# Altium schematic sheet HW_HDSP2072.SchDoc
size A3
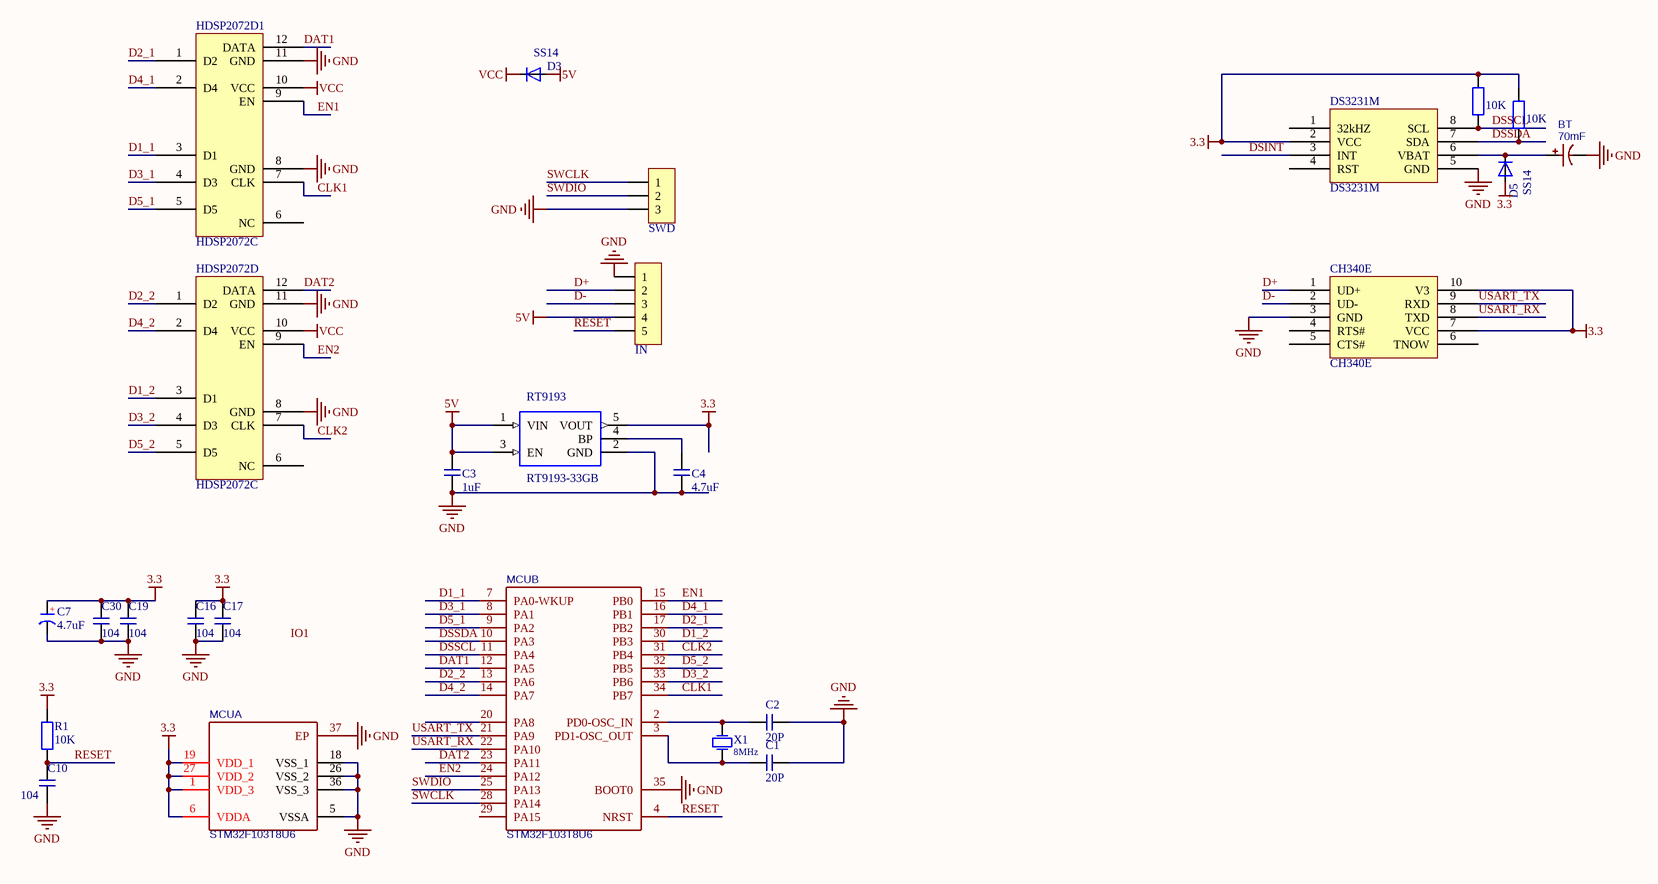
[diagram p0: HW_HDSP2072.SchDoc]

## Parts
BT  70mF  [CAP-TH_BD4.8-P3.95_SM3R3703T01]
C1  20P  [0603C]
C2  20P  [0603C]
C3  1uF  [0603C]
C4  4.7uF  [0603C]
C7  4.7uF  [3528-B-TA]
C10  104  [0603C]
C16  104  [0603C]
C17  104  [0603C]
C19  104  [0603C]
C30  104  [0603C]
CH340E  CH340E  [MSOP10_L]
D3  SS14  [SOD323_1N4148WS]
D5  SS14  [SOD323_1N4148WS]
DS3231M  DS3231M  [SOP8]
HDSP2072D  HDSP2072C  [HDSP2072SH]
HDSP2072D1  HDSP2072C  [HDSP2072SH]
IN  HDR-1X5  [ZH1.5-LS-5P]  (value not drawn)
MCU  STM32F103T8U6  [VFQFPN36_L6.0-W6.0-P0.50-BL-EP3.7]  (parts A,B of 2)
R1  10K  [0603R]
R4  10K  [0603R]
R10  10K  [0603R]
RT9193  RT9193-33GB  [sot23-5]
SWD  HDR-1X3  [ZH1.5-LS-3P]  (value not drawn)
X1  value 8MHz  [OSC 5032-2P]  (hidden comment: 1.6.1.01.005.001)

## Nets
3.3: C7.1(A) C16.1 C17.1 C19.1 C30.1 CH340E.7(VCC) CH340E.10(V3) D5.A DS3231M.2(VCC) MCU.1(VDD_3) MCU.6(VDDA) MCU.19(VDD_1) MCU.27(VDD_2) R1.1 R4.1 R10.1 RT9193.5(VOUT)
5V: C3.2 D3.A IN.4 RT9193.1(VIN) RT9193.3(EN)
GND: BT.2 C1.1 C2.1 C3.1 C4.1 C7.2(K) C10.2 C16.2 C17.2 C19.2 C30.2 CH340E.3(GND) DS3231M.5(GND) HDSP2072D.8(GND) HDSP2072D.11(GND) HDSP2072D1.8(GND) HDSP2072D1.11(GND) IN.1 MCU.5(VSSA) MCU.18(VSS_1) MCU.26(VSS_2) MCU.35(BOOT0) MCU.36(VSS_3) MCU.37(EP) RT9193.2(GND) SWD.3
VCC: D3.C HDSP2072D.10(VCC) HDSP2072D1.10(VCC)
CLK1: HDSP2072D1.7(CLK) MCU.34(PB7)
CLK2: HDSP2072D.7(CLK) MCU.31(PB4)
D1_1: HDSP2072D1.3(D1) MCU.7(PA0-WKUP)
D1_2: HDSP2072D.3(D1) MCU.30(PB3)
D2_1: HDSP2072D1.1(D2) MCU.17(PB2)
D2_2: HDSP2072D.1(D2) MCU.13(PA6)
D3_1: HDSP2072D1.4(D3) MCU.8(PA1)
D3_2: HDSP2072D.4(D3) MCU.33(PB6)
D4_1: HDSP2072D1.2(D4) MCU.16(PB1)
D4_2: HDSP2072D.2(D4) MCU.14(PA7)
D5_1: HDSP2072D1.5(D5) MCU.9(PA2)
D5_2: HDSP2072D.5(D5) MCU.32(PB5)
D+: CH340E.1(UD+) IN.2
D-: CH340E.2(UD-) IN.3
DAT1: HDSP2072D1.12(DATA) MCU.12(PA5)
DAT2: HDSP2072D.12(DATA) MCU.23(PA11)
DSINT: DS3231M.3(INT)
DSSCL: DS3231M.8(SCL) MCU.11(PA4) R10.2
DSSDA: DS3231M.7(SDA) MCU.10(PA3) R4.2
EN1: HDSP2072D1.9(EN) MCU.15(PB0)
EN2: HDSP2072D.9(EN) MCU.24(PA12)
RESET: C10.1 IN.5 MCU.4(NRST) R1.2
SWCLK: MCU.28(PA14) SWD.1
SWDIO: MCU.25(PA13) SWD.2
USART_RX: CH340E.8(TXD) MCU.22(PA10)
USART_TX: CH340E.9(RXD) MCU.21(PA9)
NetBT_1: BT.1 D5.C DS3231M.6(VBAT)
NetC1_2: C1.2 MCU.3(PD1-OSC_OUT) X1.2(OSC2)
NetC2_2: C2.2 MCU.2(PD0-OSC_IN) X1.1(OSC1)
NetC4_2: C4.2 RT9193.4(BP)

Not connected (* = marked no-connect by the designer): CH340E 4(RTS#) 5(CTS#) 6(TNOW); DS3231M 1(32kHZ) 4(RST); HDSP2072D 6(NC); HDSP2072D1 6(NC); MCU 20(PA8) 29(PA15)

## Notes on the sheet
- Labels drawn without touching a wire or pin: IO1
- (in symbol C-CD) +

## Library data of the parts
BT = 70mF: BOM_Manufacturer: KORCHIP; BOM_Manufacturer Part: SM3R3703T01; nameAlias: Capacitance; Contributor: LCSC; BOM_Supplier: LCSC; BOM_Supplier Part: C132600; spicePre: C; spiceSymbolName: SM3R3703T01
C1-C4 C10 C16 C17 C19 C30 = 电容
C7 = C-CD: 贴片钽电容; 版权归属: 源创客; BOM名称: 贴片钽电容; 学习资源: www.ooocke.com
D3 D5 = 1N4148WS: Diode Switching 75V 0.3A 2-Pin SOD-323 T/R; MF: ON Semiconductor; SnapEDA_Link: https://www.snapeda.com/parts/1N4148WS/ON%20Semiconductor/view-part/?ref=snap; Price: None; Availability: Unavailable; MP: 1N4148WS; Package: S-0 Good-Ark; Value: *
HDSP2072D HDSP2072D1 = HDSP2072
IN = Header 5: 5P接插件; 版权归属: 源创客; BOM名称: 5P接插件; 学习资源: www.ooocke.com
MCU = STM32F103T8U6: BOM_Manufacturer: ST; subpart_no: 2; tags: STM32; BOM_Supplier Part: C19671; BOM_Supplier: LCSC; BOM_Manufacturer Part: STM32F103T8U6; image: http://image.lceda.cn/szlcsc/C19671.jpg; spicePre: U; spiceSymbolName: STM32F103T8U6
R1 R4 R10 = R: 贴片电阻; 版权归属: 源创客; BOM名称: 贴片电阻; 学习资源: www.ooocke.com
RT9193 = RT9193-33GB: RT9193 Series 300 mA 3.3 V Ultra-Low Noise Ultra-Fast CMOS LDO Regulator-SC-70-5; MF: Richtek USA; SnapEDA_Link: https://www.snapeda.com/parts/RT9193-33GB/Richtek%20USA%20Inc./view-part/?ref=snap; Price: None; Availability: Unavailable; Package: SOT-23-5 Richtek; MP: RT9193-33GB; Value: *
SWD = Header 3: 3P接插件; 版权归属: 源创客; BOM名称: 3P接插件; 学习资源: www.ooocke.com
X1 = 1.6.1.01.005.001: XTAL,8MHz,±20PPM,12.6*4.5; K3 No.: 1.6.1.01.005.001; GENERAL: *